# EAGLE design ESP8266-03-Switch (EAGLE 6.2)
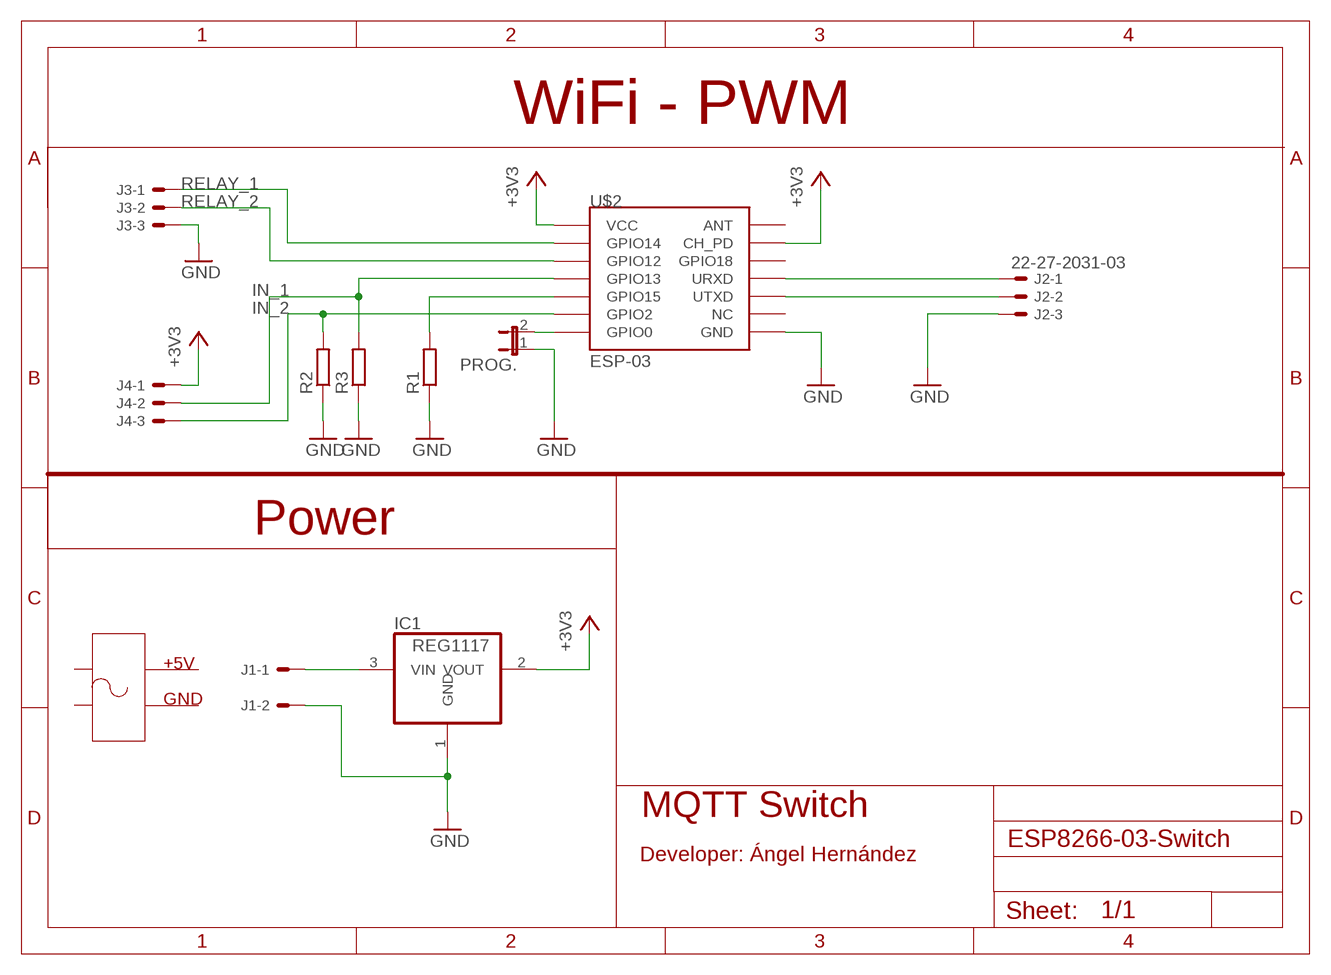
[diagram p0: schematic, sheet 1]

## Parts
IC1  REG1117  [SOT223]
J1  22-27-2021-02  [6410-02]
J2  22-27-2031-03  [6410-03]
J3  22-27-2031-03  [6410-03]
J4  22-27-2031-03  [6410-03]
PROG.  JP1E  [JP1]
R1  R-EU_0204/7  [0204/7]
R2  R-EU_0204/7  [0204/7]
R3  R-EU_0204/7  [0204/7]
U$2  ESP-03  [ESP-03]

## Nets
+3V3: IC1.2(VOUT) J4.1 U$2.CH_PD U$2.VCC
GND: IC1.1(GND) J1.2 J2.3 J3.3 PROG..1 R1.1 R2.1 R3.1 U$2.GND
IN_1: J4.2 R3.2 U$2.GPIO13
IN_2: J4.3 R2.2 U$2.GPIO2
N$1: IC1.3(VIN) J1.1
N$2: PROG..2 U$2.GPIO0
N$3: J2.1 U$2.URXD
N$4: J2.2 U$2.UTXD
N$6: R1.2 U$2.GPIO15
RELAY_1: J3.1 U$2.GPIO14
RELAY_2: J3.2 U$2.GPIO12
Unconnected: U$2.ANT U$2.GPIO18 U$2.NC

## Notes on the sheet
- WiFi - PWM
- Power
- +5V
- GND
- MQTT Switch
- Developer: Ángel Hernández

## Library data of the parts
IC1 = burr-brown:REG1117: 800mA and 1A Low Dropout (LDO) Positive Regulator 1.8V, 2.5V, 2.85V, 3.3V, 5V, and Adj; MPN: REG1117; OC_FARNELL: 1097566; OC_NEWARK: 14P6981
J1 = con-molex:22-?-02: CONNECTOR wire to board 2.54 mm (.1 inch) pitch header; OC_FARNELL: unknown; OC_NEWARK: unknown
J2-J4 = con-molex:22-?-03: CONNECTOR wire to board 2.54 mm (.1 inch) pitch header; OC_FARNELL: unknown; OC_NEWARK: unknown
PROG. = jumper:JP1E: JUMPER
R1-R3 = rcl:R-EU_: RESISTOR, European symbol
U$2 = esp8266modules:ESP-03: ESP8266 Wifi Module ESP-03; DIMENSIONS: 17.3 x 12.1 mm; PINS: 14; PITCH: 0.078" / 2 mm

## Board
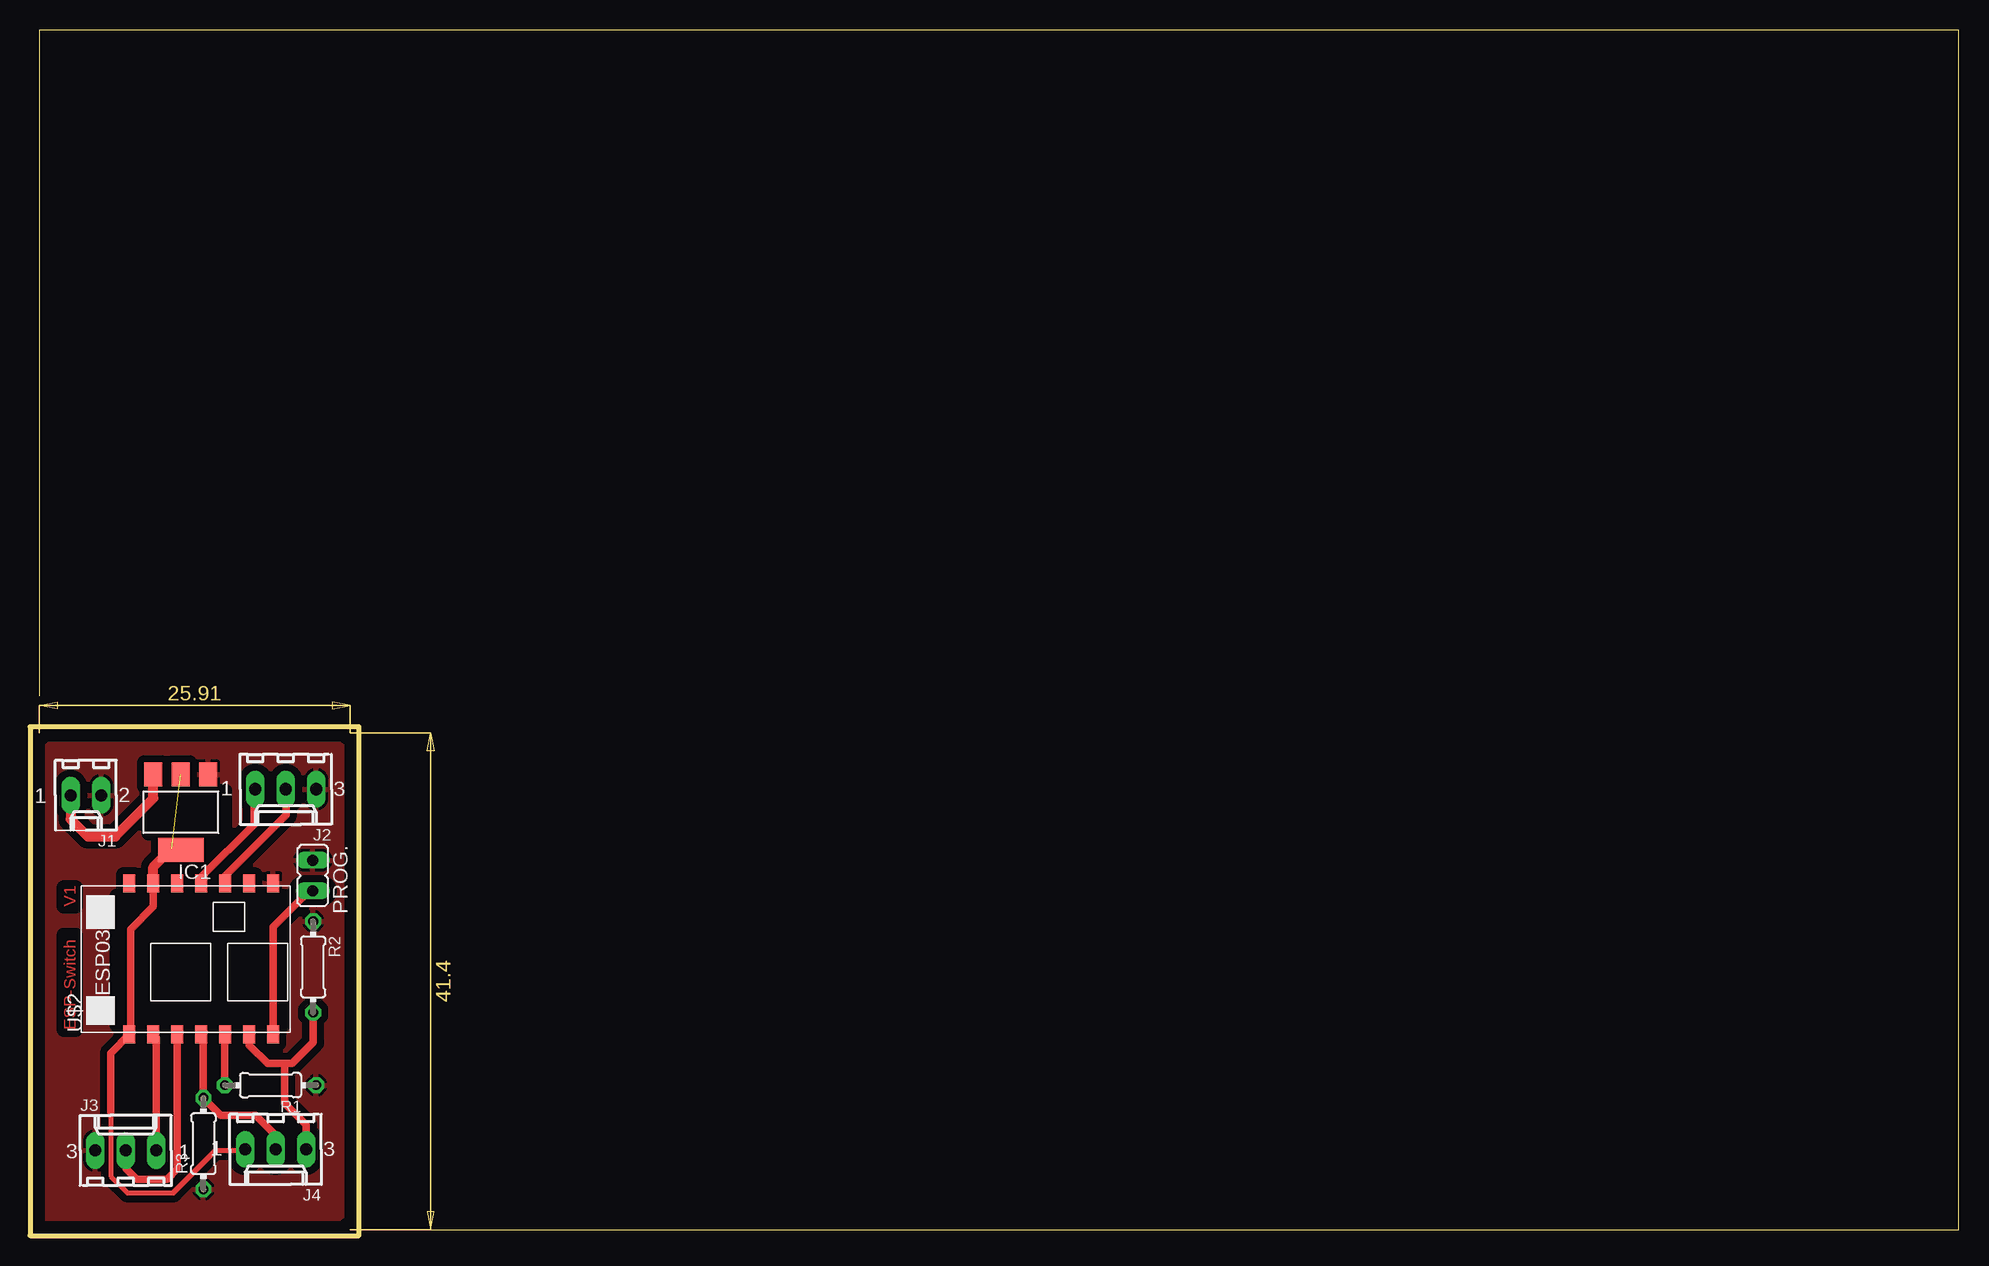
[diagram p1: board, top side]

Size 160.76 x 100.51 mm. Coordinates in mm from the lower left corner, seen from the top.
Outline: 28.76,0.51 160.76,0.51 160.76,100.51 0.76,100.51 0.76,45.01
Outline: 0,0 27.43,0 27.43,42.42 0,42.42 0,0
Copper layers (1*16): Top 0.035mm / dielectric 1.5mm / Bottom 0.035mm
Design rules: minimum track width 10mil, minimum drill 24mil, track to track 8mil, track to pad 8mil, pad to pad 8mil, via to via 8mil, smd to smd 8mil, copper to edge 40mil, drill to drill 8mil, minimum pad ring 10mil, minimum via ring 8mil, stop-mask expansion 4mil, vias tented up to drill 0mil, thermal gap 10mil
tRestrict: area 9.9,33.5 to 16.3,37.1; area 7.2,17.5 to 21.1,28.3

### Footprints (pad centres in the part's own frame; a part is rotated, then mirrored left to right if it is on the bottom)
SOT223 = smd 1.499 x 2.007: 1 -2.261,-3.15; 2 0.025,-3.15; 3 2.311,-3.15 | smd 3.81 x 2.007: 4 0,3.15
6410-02 = drill 1.016 long: 1 1.27,0; 2 -1.27,0
6410-03 = drill 1.016 long: 1 2.54,0; 2 0,0; 3 -2.54,0
JP1 = drill 0.914 long: 1 0,-1.27; 2 0,1.27
0204/7 = drill 0.813 octagon: 1 -3.81,0; 2 3.81,0
ESP-03 = smd 1.5 x 1: ANT 7.4,4.8; CH_PD 7.4,2.8; GND 7.4,-7.2; GPIO0 -5.2,-7.2; GPIO2 -5.2,-5.2; GPIO12 -5.2,0.8; GPIO13 -5.2,-1.2; GPIO14 -5.2,2.8; GPIO15 -5.2,-3.2; GPIO18 7.4,0.8; NC 7.4,-5.2; URXD 7.4,-1.2; UTXD 7.4,-3.2; VCC -5.2,4.8

### Placement (x,y rotation side)
IC1  12.58,35.3 180 top
J1  4.66,36.71 180 top
J2  21.32,37.21 180 top
J3  7.98,7.1 0 top
J4  20.47,7.19 180 top
PROG.  23.57,30.01 180 top
R1  20.05,12.54 180 top
R2  23.6,22.4 270 top
R3  14.46,7.67 90 top
U$2  13.08,21.96 90 top

### Tracks (layer width: path | path; a pad name or v marks a point on that pad's centre or on a via)
+3V3  (1 unrouted)
  Top 0.254: 8.38,17.02 U$2.VCC
  Top 0.406: 6.73,10.29 6.73,4.95 8.13,3.56 11.94,3.56 15.49,7.11 17.85,7.11 J4.1
  Top 0.61: U$2.CH_PD 10.28,27.43 8.38,25.53 8.38,17.02 | U$2.VCC 6.73,15.21 6.73,10.29
  Top 0.813: U$2.CH_PD 10.28,30.73 11.81,32.26
GND
  pour Top (isolate 0.61): 0.76,41.91 26.67,41.91 26.67,0.51 0.76,0.51
IN_1
  Top 0.254: 14.73,17.02 U$2.GPIO13
  Top 0.61: J4.2 20.47,8.36 18.8,10.03 15.9,10.03 R3.2 14.46,16.59 U$2.GPIO13
IN_2
  Top 0.406: 23.62,18.57 R2.2 | 21.21,14.22 21.08,14.35
  Top 0.61: U$2.GPIO2 18.28,15.88 19.81,14.35 21.08,14.35 21.84,14.35 23.62,16.13 23.62,18.57 | J4.3 23.01,9.25 21.21,11.05 21.21,14.22
N$1
  Top 0.254: 10.92,38.61 IC1.3
  Top 0.813: J1.1 3.39,34.71 4.83,33.27 7.11,33.27 10.29,36.45 10.29,38.43 IC1.3
N$2
  Top 0.61: U$2.GPIO0 20.28,25.74 22.86,28.32 22.86,28.45 22.99,28.57 23.41,28.57 PROG..2
N$3
  Top 0.61: U$2.URXD 14.28,29.9 18.67,34.29 18.67,37.1 J2.1
N$4
  Top 0.61: U$2.UTXD 16.28,30 21.34,35.05 21.34,37.19 J2.2
N$6
  Top 0.254: 16,17.02 U$2.GPIO15
  Top 0.406: 16.24,16.72 U$2.GPIO15
  Top 0.61: R1.2 16.24,16.72
RELAY_1
  Top 0.61: J3.1 10.52,16.53 U$2.GPIO14
RELAY_2
  Top 0.61: U$2.GPIO12 12.28,5.55 11.43,4.7 8.89,4.7 8,5.59 8,7.08 J3.2

### Text on the board
Top: V1 | ESP-Switch